# EAGLE design STM32L0 (EAGLE 9.6.2)

## Sheet 1 of 2
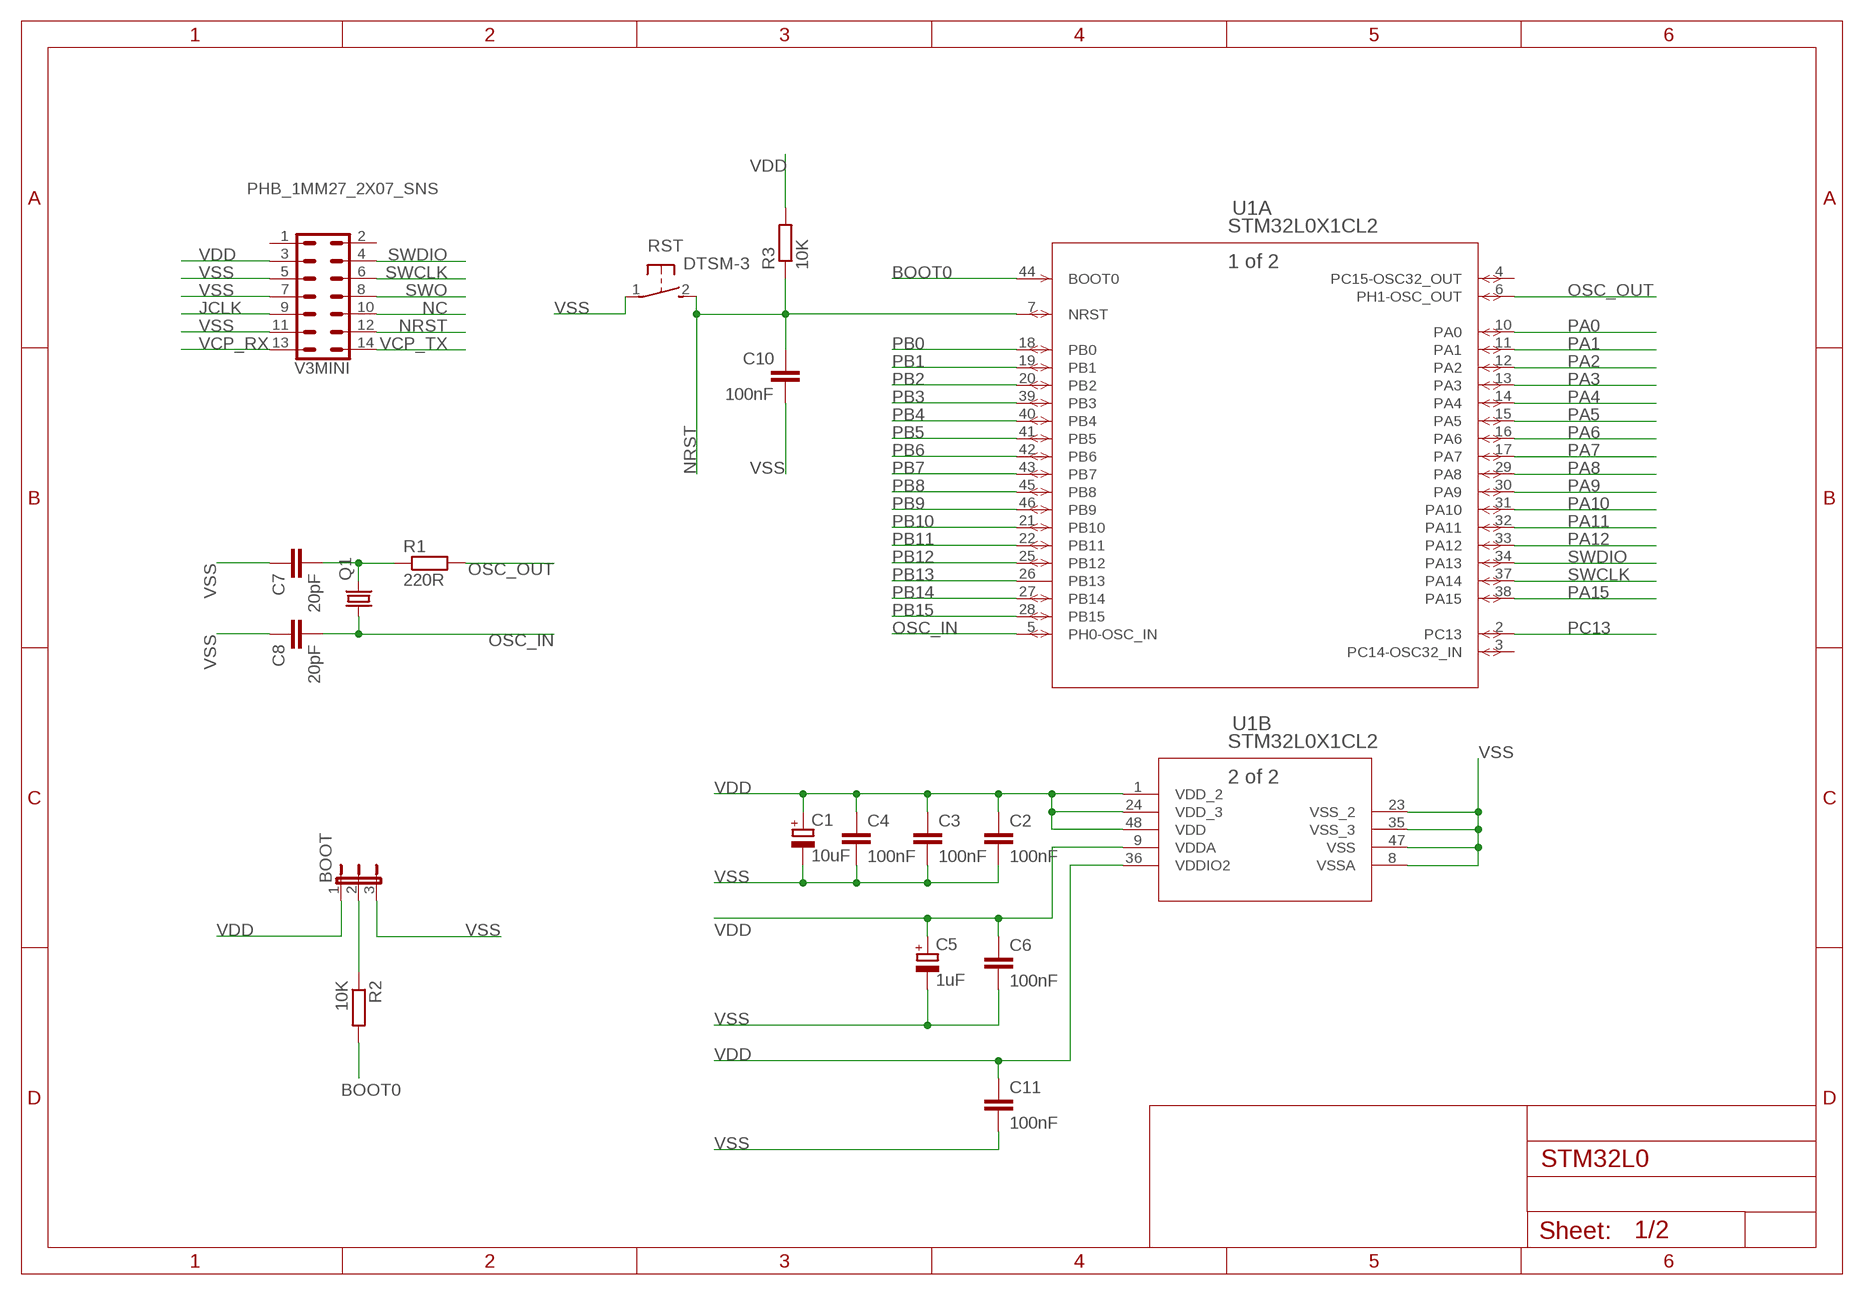
[diagram p0: schematic, sheet 1]

### Parts
BOOT  JP2E  [JP2]
C1  10uF  CPOL-EUSMCA  [SMC_A]
C2  100nF  C-EUC0805  [C0805]
C3  100nF  C-EUC0805  [C0805]
C4  100nF  C-EUC0805  [C0805]
C5  1uF  CPOL-EUSMCA  [SMC_A]
C6  100nF  C-EUC0805  [C0805]
C7  20pF  C-EUC0805  [C0805]
C8  20pF  C-EUC0805  [C0805]
C10  100nF  C-EUC0805  [C0805]
C11  100nF  C-EUC0805  [C0805]
Q1  CRYSTALSM49  [SM49]
R1  220R  R-EU_R0805  [R0805]
R2  10K  R-EU_R0805  [R0805]
R3  10K  R-EU_R0805  [R0805]
RST  DTSM-3  [DTSM-3]
U1  STM32L0X1CL2  [LQFP48-7X7MM]
V3MINI  PHB_1MM27_2X07_SNS  [PHB_1MM27_2X07_SNS]

### Nets
BOOT0: R2.2 U1.44(A:BOOT0)
JCLK: V3MINI.9
N$1: C7.2 Q1.2 R1.1
N$2: BOOT.2 R2.1
NC: V3MINI.10
NRST: C10.1 R3.1 RST.2 U1.7(A:NRST) V3MINI.12
OSC_IN: C8.2 Q1.1 U1.5(A:PH0-OSC_IN)
OSC_OUT: R1.2 U1.6(A:PH1-OSC_OUT)
PA0: U1.10(A:PA0) ; also sheet 2
PA1: U1.11(A:PA1) ; also sheet 2
PA2: U1.12(A:PA2) ; also sheet 2
PA3: U1.13(A:PA3) ; also sheet 2
PA4: U1.14(A:PA4) ; also sheet 2
PA5: U1.15(A:PA5) ; also sheet 2
PA6: U1.16(A:PA6) ; also sheet 2
PA7: U1.17(A:PA7) ; also sheet 2
PA8: U1.29(A:PA8) ; also sheet 2
PA9: U1.30(A:PA9) ; also sheet 2
PA10: U1.31(A:PA10) ; also sheet 2
PA11: U1.32(A:PA11) ; also sheet 2
PA12: U1.33(A:PA12) ; also sheet 2
PA15: U1.38(A:PA15) ; also sheet 2
PB0: U1.18(A:PB0) ; also sheet 2
PB1: U1.19(A:PB1) ; also sheet 2
PB2: U1.20(A:PB2) ; also sheet 2
PB3: U1.39(A:PB3) ; also sheet 2
PB4: U1.40(A:PB4) ; also sheet 2
PB5: U1.41(A:PB5) ; also sheet 2
PB6: U1.42(A:PB6) ; also sheet 2
PB7: U1.43(A:PB7) ; also sheet 2
PB8: U1.45(A:PB8) ; also sheet 2
PB9: U1.46(A:PB9) ; also sheet 2
PB10: U1.21(A:PB10) ; also sheet 2
PB11: U1.22(A:PB11) ; also sheet 2
PB12: U1.25(A:PB12) ; also sheet 2
PB13: U1.26(A:PB13) ; also sheet 2
PB14: U1.27(A:PB14) ; also sheet 2
PB15: U1.28(A:PB15) ; also sheet 2
PC13: U1.2(A:PC13) ; also sheet 2
SWCLK: U1.37(A:PA14) V3MINI.6
SWDIO: U1.34(A:PA13) V3MINI.4
SWO: V3MINI.8
VCP_RX: V3MINI.13
VCP_TX: V3MINI.14
VDD: BOOT.1 C1.+ C2.1 C3.1 C4.1 C5.+ C6.1 C11.1 R3.2 U1.1(B:VDD_2) U1.9(B:VDDA) U1.24(B:VDD_3) U1.36(B:VDDIO2) U1.48(B:VDD) V3MINI.3 ; also sheet 2
VSS: BOOT.3 C1.- C2.2 C3.2 C4.2 C5.- C6.2 C7.1 C8.1 C10.2 C11.2 RST.1 U1.8(B:VSSA) U1.23(B:VSS_2) U1.35(B:VSS_3) U1.47(B:VSS) V3MINI.5 V3MINI.7 V3MINI.11 ; also sheet 2
Unconnected: U1.3(A:PC14-OSC32_IN) U1.4(A:PC15-OSC32_OUT) V3MINI.1 V3MINI.2

## Sheet 2 of 2
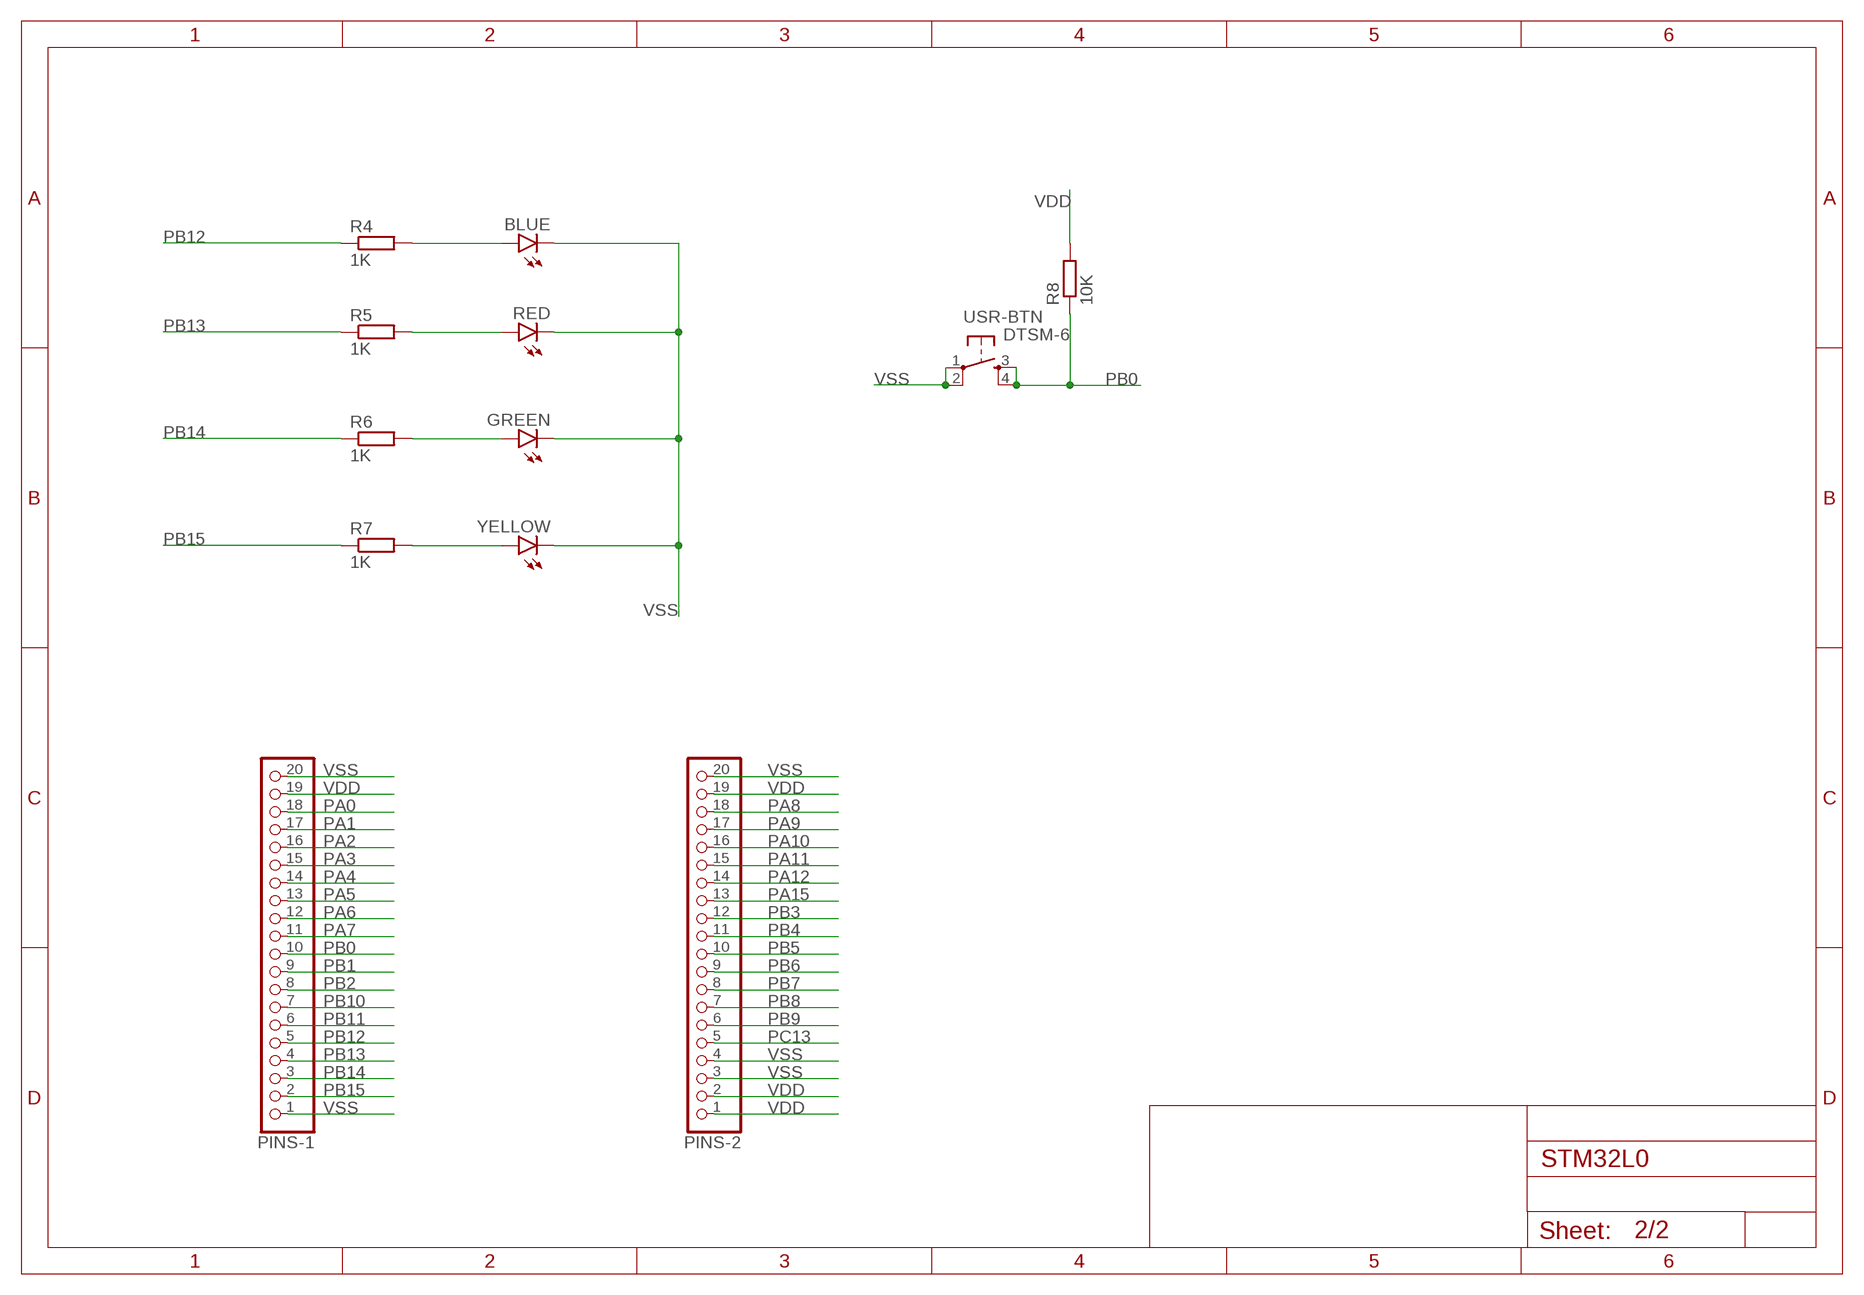
[diagram p1: schematic, sheet 2]

### Parts
BLUE  LEDCHIPLED_0805  [CHIPLED_0805]
GREEN  LEDCHIPLED_0805  [CHIPLED_0805]
PINS-1  PINHD-1X20  [1X20]
PINS-2  PINHD-1X20  [1X20]
R4  1K  R-EU_R0805  [R0805]
R5  1K  R-EU_R0805  [R0805]
R6  1K  R-EU_R0805  [R0805]
R7  1K  R-EU_R0805  [R0805]
R8  10K  R-EU_R0805  [R0805]
RED  LEDCHIPLED_0805  [CHIPLED_0805]
USR-BTN  DTSM-6  [DTSM-6]
YELLOW  LEDCHIPLED_0805  [CHIPLED_0805]

### Nets
N$4: BLUE.A R4.2
N$5: R5.2 RED.A
N$6: GREEN.A R6.2
N$7: R7.2 YELLOW.A
PA0: PINS-1.18 ; also sheet 1
PA1: PINS-1.17 ; also sheet 1
PA2: PINS-1.16 ; also sheet 1
PA3: PINS-1.15 ; also sheet 1
PA4: PINS-1.14 ; also sheet 1
PA5: PINS-1.13 ; also sheet 1
PA6: PINS-1.12 ; also sheet 1
PA7: PINS-1.11 ; also sheet 1
PA8: PINS-2.18 ; also sheet 1
PA9: PINS-2.17 ; also sheet 1
PA10: PINS-2.16 ; also sheet 1
PA11: PINS-2.15 ; also sheet 1
PA12: PINS-2.14 ; also sheet 1
PA15: PINS-2.13 ; also sheet 1
PB0: PINS-1.10 R8.1 USR-BTN.3 USR-BTN.4 ; also sheet 1
PB1: PINS-1.9 ; also sheet 1
PB2: PINS-1.8 ; also sheet 1
PB3: PINS-2.12 ; also sheet 1
PB4: PINS-2.11 ; also sheet 1
PB5: PINS-2.10 ; also sheet 1
PB6: PINS-2.9 ; also sheet 1
PB7: PINS-2.8 ; also sheet 1
PB8: PINS-2.7 ; also sheet 1
PB9: PINS-2.6 ; also sheet 1
PB10: PINS-1.7 ; also sheet 1
PB11: PINS-1.6 ; also sheet 1
PB12: PINS-1.5 R4.1 ; also sheet 1
PB13: PINS-1.4 R5.1 ; also sheet 1
PB14: PINS-1.3 R6.1 ; also sheet 1
PB15: PINS-1.2 R7.1 ; also sheet 1
PC13: PINS-2.5 ; also sheet 1
VDD: PINS-1.19 PINS-2.1 PINS-2.2 PINS-2.19 R8.2 ; also sheet 1
VSS: BLUE.C GREEN.C PINS-1.1 PINS-1.20 PINS-2.3 PINS-2.4 PINS-2.20 RED.C USR-BTN.1 USR-BTN.2 YELLOW.C ; also sheet 1

## Library data of the parts
BLUE GREEN RED YELLOW = led:LED: LED OSRAM: - CHIPLED LG R971, LG N971, LY N971, LG Q971, LY Q971, LO R971, LY R971 LH N974, LH R974 LS Q976, LO Q976, LY Q976 LO Q996 - Hyper CHIPLED LW Q18S LB Q993, LB Q99A, LB R99A - SideLED LS A670, LO A670, LY A670, LG A670, LP A670 LB A673, LV A673, LT A673, LW A673 LH A674 LY A675 LS A676, LA A676, LO A676, LY A676, LW A676 LS A679, LY A679, LG A679 - Hyper Micro SIDELED® LS Y876, LA Y876, LO Y876, LY Y876 LT Y87S - SmartLED LW L88C, LW L88S LB L89C, LB L89S, LG L890 LS L89K, LO L89K, LY L89K LS L896, LA L896, LO L896, LY L896 - TOPLED LS T670, LO T670, LY T670, LG T670, LP T670 LSG T670, LSP T670, LSY T670, LOP T670, LYG T670 LG T671, LOG T671, LSG T671 LB T673, LV T673, LT T673, LW T673 LH T674 LS T676, LA T676, LO T676, LY T676, LB T676, LH T676, LSB T676, LW T676 LB T67C, LV T67C, LT T67C, LS T67K, LO T67K, LY T67K, LW E67C LS E67B, LA E67B, LO E67B, LY E67B, LB E67C, LV E67C, LT E67C LW T67C LS T679, LY T679, LG T679 LS T770, LO T770, LY T770, LG T770, LP T770 LB T773, LV T773, LT T773, LW T773 LH T774 LS E675, LA E675, LY E675, LS T675 LS T776, LA T776, LO T776, LY T776, LB T776 LHGB T686 LT T68C, LB T68C - Hyper Mini TOPLED® LB M676 - Mini TOPLED Santana® LG M470 LS M47K, LO M47K, LY M47K Source: http://www.osram.convergy.de LUXEON: - LUMILED® LXK2-PW12-R00, LXK2-PW12-S00, LXK2-PW14-U00, LXK2-PW14-V00 LXK2-PM12-R00, LXK2-PM12-S00, LXK2-PM14-U00 LXK2-PE12-Q00, LXK2-PE12-R00, LXK2-PE12-S00, LXK2-PE14-T00, LXK2-PE14-U00 LXK2-PB12-K00, LXK2-PB12-L00, LXK2-PB12-M00, LXK2-PB14-N00, LXK2-PB14-P00, LXK2-PB14-Q00 LXK2-PR12-L00, LXK2-PR12-M00, LXK2-PR14-Q00, LXK2-PR14-R00 LXK2-PD12-Q00, LXK2-PD12-R00, LXK2-PD12-S00 LXK2-PH12-R00, LXK2-PH12-S00 LXK2-PL12-P00, LXK2-PL12-Q00, LXK2-PL12-R00 Source: www.luxeon.com KINGBRIGHT: KA-3528ASYC Source: www.kingbright.com
BOOT = jumper:JP2E: JUMPER
C1 C5 = rcl:CPOL-EU: POLARIZED CAPACITOR, European symbol; SPICEPREFIX: C
C2-C4 C6-C8 C10 C11 = rcl:C-EU: CAPACITOR, European symbol; SPICEPREFIX: C
PINS-1 PINS-2 = pinhead:PINHD-1X20: PIN HEADER
Q1 = crystal:CRYSTAL: CRYSTAL; OC_FARNELL: unknown; OC_NEWARK: unknown
R1-R8 = rcl:R-EU_: RESISTOR, European symbol; SPICEPREFIX: R
RST = switch-tact:DTSM-3
U1 = STM32L051C8T6:STM32L0X1CL2; COPYRIGHT: Copyright (C) 2016 Accelerated Designs. All rights reserved; MANUFACTURER_PART_NUMBER: STM32L0X1CL2; VENDOR: STMicroelectronics
USR-BTN = switch-tact:DTSM-6
V3MINI = _hhn_con_pinhead_box_1mm27:PHB_1MM27_2X07_*: Pin Header Box-Type, 1.27mm/0.5"/50mil Pitch, 2x07 Circuits Note: see library description for an important note about THT-version

## Board
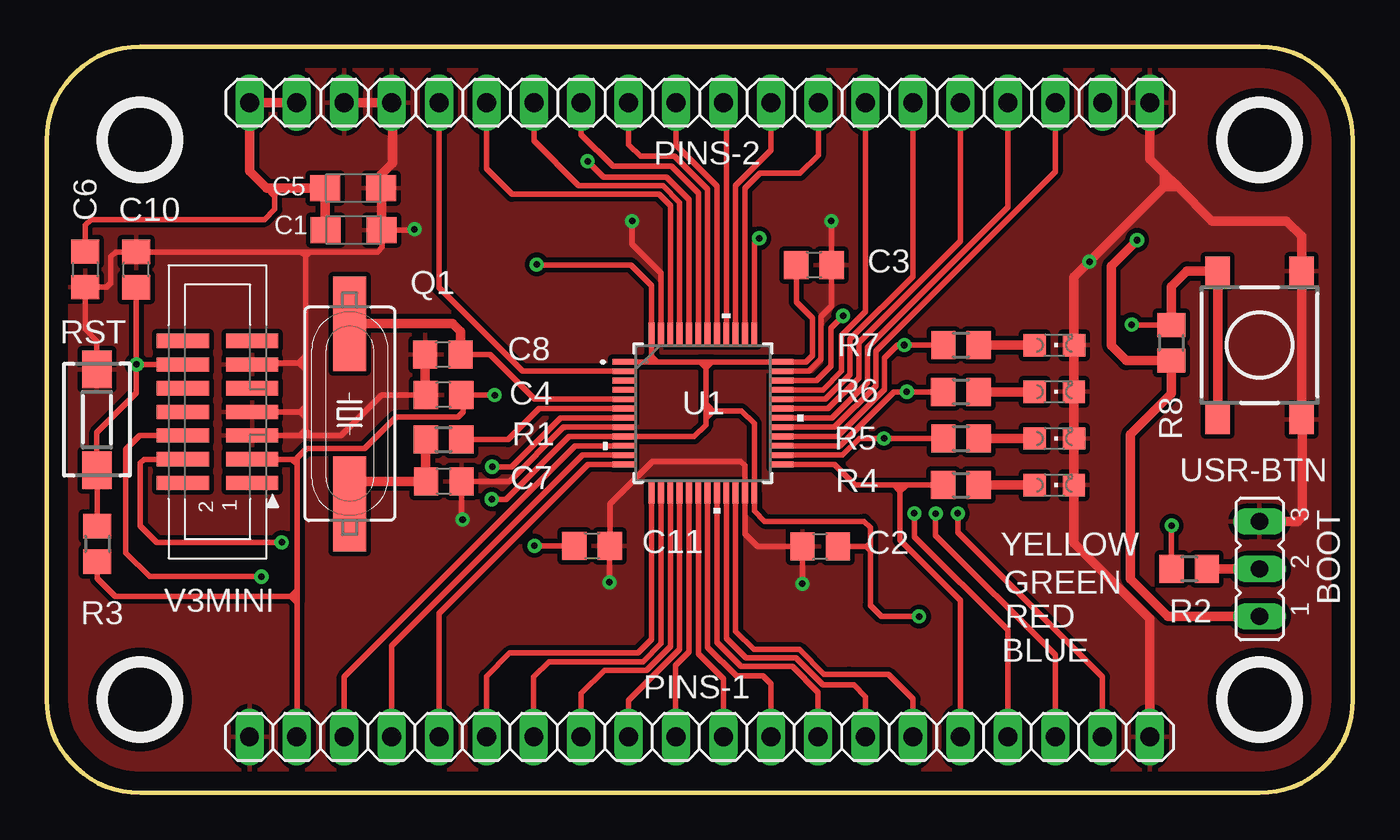
[diagram p2: board, top side]
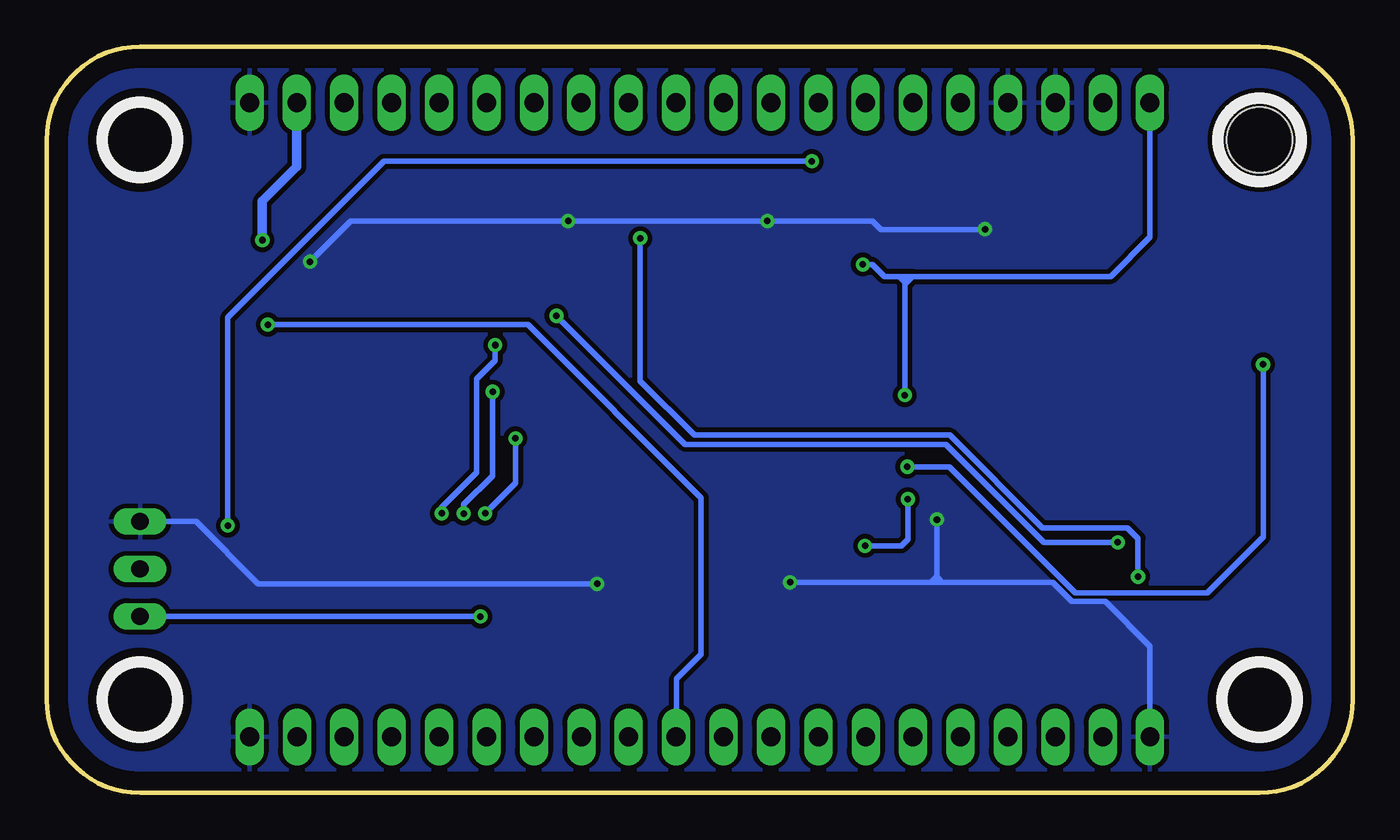
[diagram p3: board, bottom side, seen from below]

Size 70 x 40 mm. Coordinates in mm from the lower left corner, seen from the top.
Outline: 0,5 0,35 arc-90 5,40 65,40 arc-90 70,35 70,5 arc-90 65,0 5,0 arc-90 0,5
Copper layers (1*16): Top 0.035mm / dielectric 1.5mm / Bottom 0.035mm
Design rules "default": minimum track width 6mil, minimum drill 0.35mm, track to track 6mil, track to pad 6mil, pad to pad 6mil, via to via 6mil, smd to smd 6mil, copper to edge 40mil, drill to drill 6mil, minimum pad ring 10mil, minimum via ring 8mil, stop-mask expansion 4mil, vias tented up to drill 0mil, thermal gap 10mil
Holes 3.5 mm at 5,5 65,35 65,5 5,35

### Footprints (pad centres in the part's own frame; a part is rotated, then mirrored left to right if it is on the bottom)
CHIPLED_0805 = smd 1.2 x 1.2: A 0,-1.05; C 0,1.05
JP2 = drill 0.914 long: 1 -2.54,0; 2 0,0; 3 2.54,0
SMC_A = smd 1.6 x 1.4: + -1.5,0; - 1.5,0
C0805 = smd 1.3 x 1.5: 1 -0.95,0; 2 0.95,0
1X20 = drill 1.016 long: 1 -24.13,0; 2 -21.59,0; 3 -19.05,0; 4 -16.51,0; 5 -13.97,0; 6 -11.43,0; 7 -8.89,0; 8 -6.35,0; 9 -3.81,0; 10 -1.27,0; 11 1.27,0; 12 3.81,0; 13 6.35,0; 14 8.89,0; 15 11.43,0; 16 13.97,0; 17 16.51,0; 18 19.05,0; 19 21.59,0; 20 24.13,0
SM49 = smd 5.08 x 1.778: 1 -4.826,0; 2 4.826,0
R0805 = smd 1.3 x 1.5: 1 -0.95,0; 2 0.95,0
DTSM-3 = smd 2 x 1.6: 1 -2.7,0; 2 2.7,0
LQFP48-7X7MM = smd 1.194 x 0.305: 1 -4.25,2.75; 2 -4.25,2.25; 3 -4.25,1.75; 4 -4.25,1.25; 5 -4.25,0.75; 6 -4.25,0.25; 7 -4.25,-0.25; 8 -4.25,-0.75; 9 -4.25,-1.25; 10 -4.25,-1.75; 11 -4.25,-2.25; 12 -4.25,-2.75; 25 4.25,-2.75; 26 4.25,-2.25; 27 4.25,-1.75; 28 4.25,-1.25; 29 4.25,-0.75; 30 4.25,-0.25; 31 4.25,0.25; 32 4.25,0.75; 33 4.25,1.25; 34 4.25,1.75; 35 4.25,2.25; 36 4.25,2.75 | smd 0.305 x 1.194: 13 -2.75,-4.25; 14 -2.25,-4.25; 15 -1.75,-4.25; 16 -1.25,-4.25; 17 -0.75,-4.25; 18 -0.25,-4.25; 19 0.25,-4.25; 20 0.75,-4.25; 21 1.25,-4.25; 22 1.75,-4.25; 23 2.25,-4.25; 24 2.75,-4.25; 37 2.75,4.25; 38 2.25,4.25; 39 1.75,4.25; 40 1.25,4.25; 41 0.75,4.25; 42 0.25,4.25; 43 -0.25,4.25; 44 -0.75,4.25; 45 -1.25,4.25; 46 -1.75,4.25; 47 -2.25,4.25; 48 -2.75,4.25
DTSM-6 = smd 1.55 x 1.3: 1 -3.975,2.25; 2 3.975,2.25; 3 -3.975,-2.25; 4 3.975,-2.25
PHB_1MM27_2X07_SNS = smd 0.76 x 2.8: 1 -3.81,-1.85; 2 -3.81,1.85; 3 -2.54,-1.85; 4 -2.54,1.85; 5 -1.27,-1.85; 6 -1.27,1.85; 7 0,-1.85; 8 0,1.85; 9 1.27,-1.85; 10 1.27,1.85; 11 2.54,-1.85; 12 2.54,1.85; 13 3.81,-1.85; 14 3.81,1.85

### Placement (x,y rotation side)
BLUE  54,16.5 270 top
BOOT  65,12 90 top
C1  16.46,30.17 0 top
C2  41.45,13.2 180 top
C3  41.12,28.3 0 top
C4  21.27,21.33 180 top
C5  16.43,32.41 0 top
C6  2.07,28.06 270 top
C7  21.29,16.69 180 top
C8  21.23,23.5 0 top
C10  4.8,28.05 90 top
C11  29.23,13.25 0 top
GREEN  54,21.5 270 top
PINS-1  35,3 180 top
PINS-2  35,37 0 top
Q1  16.24,20.32 270 top
R1  21.27,18.94 0 top
R2  61.23,12 180 top
R3  2.72,13.34 270 top
R4  49,16.5 0 top
R5  49,19 0 top
R6  49,21.5 0 top
R7  49,24 0 top
R8  60.26,24.12 270 top
RED  54,19 270 top
RST  2.69,20 270 top
U1  35.17,20.35 0 top
USR-BTN  65,24 270 top
V3MINI  9.16,20.42 90 top
YELLOW  54,24 270 top

### Tracks (layer width: path | path; a pad name or v marks a point on that pad's centre or on a via)
BOOT0  (via drill 0.35)
  Top 0.305: U1.44 34.42,31.8 33.22,33 29.85,33 v28.99,33.86 | R2.2 v60.28,14.32 v60.29,14.33
  Bottom 0.305: v60.29,14.33 60.29,25.49 51.92,33.86 v28.99,33.86
N$1
  Top 0.508: R1.1 20.32,16.71 C7.2 16.84,16.69 16.24,16.09 Q1.2
N$2
  Top 0.508: 64.95,12 R2.1
  Top 1.27: BOOT.2 | BOOT.2 64.95,12
N$4
  Top 0.508: R4.2 BLUE.A
N$5
  Top 0.508: R5.2 RED.A
N$6
  Top 0.508: R6.2 GREEN.A
N$7
  Top 0.508: R7.2 YELLOW.A
NRST  (via drill 0.35)
  Top 0.305: U1.7 27.53,20.1 24.91,17.48 v23.88,17.48 | v4.81,22.97 V3MINI.12 | R3.1 2.72,17.28 RST.2 2.69,19.32 4.81,21.43 v4.81,22.97 | C10.1 v4.81,22.97
  Bottom 0.305: v23.88,17.48 21.63,17.48 14.86,10.71 7.81,10.71 4.81,13.71 v4.81,22.97
OSC_IN
  Top 0.305: C8.2 23.76,23.5 26.16,21.1 U1.5
  Top 0.508: C8.2 22.18,24.73 21.75,25.16 16.25,25.16 Q1.1
OSC_OUT
  Top 0.305: U1.6 26.38,20.6 24.72,18.94 R1.2
PA0
  Top 0.305: U1.10 28.33,18.6 15.95,6.22 PINS-1.18
  Top 1.27: PINS-1.18
PA1
  Top 0.305: U1.11 28.71,18.1 18.49,7.88 18.49,3.02
  Top 1.27: PINS-1.17 18.49,3.02
PA2
  Top 0.305: U1.12 29.01,17.6 21.03,9.62 21.03,3.02
  Top 1.27: PINS-1.16 21.03,3.02
PA3
  Top 0.305: U1.13 32.42,8.22 31.69,7.49 24.81,7.49 23.57,6.25 23.57,3.02
  Top 1.27: PINS-1.15 23.57,3.02
PA4
  Top 0.305: U1.14 32.92,8.01 31.95,7.03 26.92,7.03 26.11,6.22 26.11,3.07
  Top 1.27: PINS-1.14 26.11,3.07
PA5
  Top 0.305: U1.15 33.42,7.86 32.14,6.58 29.9,6.58 28.65,5.33 28.65,3.04
  Top 1.27: PINS-1.13 28.65,3.04
PA6
  Top 0.305: U1.16 33.92,7.7 31.19,4.97 31.19,3.06
  Top 1.27: PINS-1.12 31.19,3.06
PA7
  Top 0.305: U1.17 34.42,7.55 33.71,6.84 33.71,3.03
  Top 1.27: PINS-1.11 33.73,3.02 33.71,3.03
PA8
  Top 0.305: U1.29 42.22,19.6 44.43,21.81 44.43,23.68 54.05,33.3 54.05,36.95
  Top 1.27: PINS-2.18 54.05,36.95
PA9
  Top 0.305: U1.30 42.07,20.1 43.98,22 43.98,23.87 51.51,31.41 51.51,36.98
  Top 1.27: PINS-2.17 51.51,36.98
PA10
  Top 0.305: U1.31 41.88,20.6 43.52,22.24 43.52,24.13 48.97,29.58 48.97,36.97
  Top 1.27: PINS-2.16 48.97,36.97
PA11
  Top 0.305: U1.32 41.73,21.1 43.06,22.43 43.06,24.32 46.43,27.69 46.43,36.95
  Top 1.27: PINS-2.15 46.43,36.95
PA12
  Top 0.305: U1.33 41.59,21.6 42.6,22.62 42.6,24.51 43.89,25.79 PINS-2.14
  Top 1.27: PINS-2.14
PA15
  Top 0.305: U1.38 37.42,32.41 38.22,33.21 40.38,33.21 41.35,34.18 41.35,36.93
  Top 1.27: PINS-2.13 41.35,36.93
PB0  (via drill 0.35)
  Top 0.305: U1.18 34.92,7.46 36.27,6.11 36.27,3.03 | R8.1 58.18,25.07 v58.15,25.1
  Top 0.508: USR-BTN.4 USR-BTN.3 61.1,27.97 60.26,27.13 R8.1
  Top 1.27: PINS-1.10 36.27,3.03
  Bottom 0.305: v58.15,25.1 44.21,25.1 34.92,15.81 34.92,7.43 36.24,6.11 36.24,3.02
  Bottom 1.27: PINS-1.10 36.24,3.02
PB1
  Top 0.305: U1.19 35.42,7.81 36.96,6.27 38.38,6.27 38.81,5.84 38.81,3.09
  Top 1.27: PINS-1.9 38.81,3.09
PB2
  Top 0.305: U1.20 35.92,8.07 37.22,6.77 39.96,6.77 41.35,5.38 41.35,3.02
  Top 1.27: PINS-1.8 41.35,3.02
PB3
  Top 0.305: U1.39 36.92,32.56 38.81,34.45 38.81,36.95
  Top 1.27: PINS-2.12 38.81,36.95
PB4
  Top 0.305: U1.40 36.42,36.4 36.27,36.55 36.27,36.95
  Top 1.27: PINS-2.11 36.27,36.95
PB5
  Top 0.305: U1.41 35.92,32.52 33.73,34.71 33.73,36.96
  Top 1.27: PINS-2.10 33.73,36.96
PB6
  Top 0.305: U1.42 35.42,32.36 33.66,34.12 31.82,34.12 31.19,34.75 31.19,36.95
  Top 1.27: PINS-2.9 31.19,36.95
PB7
  Top 0.305: U1.43 34.92,32.15 33.48,33.59 30.34,33.59 28.65,35.28 PINS-2.8
  Top 1.27: PINS-2.8
PB8
  Top 0.305: U1.45 33.92,31.65 33.03,32.54 28.52,32.54 26.11,34.95 PINS-2.7
  Top 1.27: PINS-2.7
PB9
  Top 0.305: U1.46 33.42,31.47 32.8,32.09 24.93,32.09 23.57,33.45 23.57,36.96
  Top 1.27: PINS-2.6 23.57,36.96
PB10
  Top 0.305: U1.21 36.42,8.29 37.48,7.23 40.15,7.23 41.6,5.78 43.25,5.78 43.87,5.16 43.87,3.04
  Top 1.27: PINS-1.7 43.89,3.02 43.87,3.04
PB11
  Top 0.305: U1.22 36.92,8.66 37.9,7.68 40.34,7.68 41.67,6.36 43.01,6.36 43.02,6.35 45.11,6.35 46.43,5.03 46.43,3.05
  Top 1.27: PINS-1.6 46.43,3.05
PB12
  Top 0.305: U1.25 42.22,17.6 43.32,16.5 45.41,16.5 | 45.41,16.5 45.74,16.5 | 45.74,16.5 46.04,16.5 | 46.04,16.5 R4.1 | 45.74,16.5 45.74,16.17 | 45.74,16.15 45.74,13.55 48.97,10.32 48.97,3.02 | 45.74,16.15 46.04,16.45 46.04,16.5 | 45.74,16.15 45.74,16.17 | 45.74,16.17 45.41,16.5
  Top 1.27: PINS-1.5 48.97,3.02
PB13  (via drill 0.35)
  Top 0.305: U1.26 42.66,18.1 43.56,19 v44.88,19 R5.1 | v46.5,14.98 46.51,14.97 46.51,13.73 51.51,8.73 PINS-1.4
  Top 1.27: PINS-1.4
  Bottom 0.305: v44.88,19 44.88,16.6 v46.5,14.98
PB14  (via drill 0.35)
  Top 0.305: U1.27 42.51,18.6 45.41,21.5 v46.1,21.5 R6.1 | v47.65,14.97 v47.64,14.96 47.64,13.81 54.05,7.4 PINS-1.3
  Bottom 0.305: v46.1,21.5 46.1,17 47.65,15.45 v47.65,14.97
PB15  (via drill 0.35)
  Top 0.305: U1.28 42.37,19.1 44.89,21.62 44.89,23.31 45.59,24 v45.96,24 R7.1 | v48.83,14.98 48.83,13.97 56.59,6.21 56.59,3.04
  Top 1.27: PINS-1.2 56.59,3.04
  Bottom 0.305: v45.96,24 45.96,23.18 46.95,22.19 46.95,17.18 48.83,15.3 v48.83,14.98
PC13
  Top 0.305: U1.2 25.51,22.6 21.03,27.08 21.03,36.98
  Top 1.27: PINS-2.5 21.03,36.98
SWCLK  (via drill 0.35)
  Top 0.305: U1.37 37.92,29.46 v38.19,29.73 | V3MINI.6 4.98,19.15 4.24,18.41 4.24,12.87 5.52,11.59 v11.51,11.59
  Bottom 0.305: v38.19,29.73 38.19,22.08 35.29,19.18 21.6,19.18 16.63,14.21 12.08,14.21 11.51,13.64 v11.51,11.59
SWDIO  (via drill 0.35)
  Top 0.305: U1.34 41.25,22.1 42.04,22.89 42.04,24.92 v42.68,25.56 v42.68,25.57 | V3MINI.4 5.22,17.88 5.01,17.67 5.01,14.31 5.89,13.43 v12.6,13.43
  Bottom 0.305: v42.68,25.57 35.79,18.68 21.81,18.68 16.56,13.43 v12.6,13.43
VDD  (via drill 0.35)
  Top 0.305: 43.93,13.2 C2.1 | 44.14,13.41 44.14,14.22 43.8,14.56 38.47,14.56 37.92,15.11 U1.24 37.92,19.79 37.23,20.48 35.71,20.48 | 44.14,13.41 43.93,13.2 | C3.1 40.17,26.31 41.04,25.44 41.04,23.44 40.7,23.1 U1.36 35.63,23.1 | U1.1 32.14,23.1 | 32.14,23.1 32.41,23.1 | 32.41,23.1 32.72,23.1 | 32.72,23.1 35.03,23.1 | 35.03,23.1 35.33,23.1 | 35.33,23.1 35.63,23.1 | 32.42,23.4 U1.48 32.42,27.19 31.31,28.3 26.28,28.3 v26.26,28.32 | 32.42,23.4 32.42,23.11 32.41,23.1 | 32.42,23.4 32.72,23.1 | 32.42,23.4 32.14,23.12 32.14,23.1 | 35.33,20.1 35.33,19.73 34.7,19.1 U1.9 27.99,19.1 24.63,15.74 v23.85,15.74 | 35.33,20.1 35.33,20.48 | 35.33,20.48 35.33,20.76 | 35.33,20.76 35.33,22.8 | 35.33,22.8 35.33,23.1 | 35.33,22.8 35.03,23.1 | 35.33,22.8 35.63,23.1 | 35.71,20.48 35.33,20.48 | 35.71,20.48 35.43,20.76 35.33,20.76 | 35.71,20.48 35.33,20.1 | v26.14,13.24 v26.15,13.25 C11.1 | C4.1 22.33,21.33 | 22.33,21.33 v24,21.33 v24.01,21.32 | 44.14,13.41 44.14,12.99 | 44.14,12.99 44.14,10.06 44.74,9.46 v46.74,9.46 v46.75,9.45 | 43.93,13.2 44.14,12.99 | V3MINI.3 13.14,17.88 | 13.14,17.88 13.33,17.88 13.42,17.79 | 13.42,17.79 13.42,17.6 | 13.42,17.6 13.42,10.85 | 13.42,10.85 13.42,10.53 | 13.42,10.53 13.42,10.21 | 13.42,3.13 13.42,10.21 | C6.1 2.07,30.42 2.39,30.74 11.68,30.74 12.23,31.29 12.23,31.97 | 12.23,32.09 12.23,32.41 | 12.23,31.97 11.79,32.41 | 12.23,31.97 12.23,32.09 | 12.23,32.09 12.55,32.41 | 13.42,17.79 13.42,17.95 13.93,18.46 17.04,18.46 18.72,20.14 22.06,20.14 22.33,20.41 22.33,21.33 | 13.14,17.88 13.42,17.6 | 13.1,10.53 3.68,10.53 2.72,11.49 R3.2 | 13.1,10.53 13.42,10.53 | 13.1,10.53 13.42,10.85 | 13.1,10.53 13.42,10.21
  Top 0.508: C1.+ 14.93,30.2 C5.+ 12.55,32.41 12.23,32.41 11.79,32.41 10.87,33.33 PINS-2.1 13.39,37 | 64.94,9.46 60.09,9.46 58.08,11.47 58.08,19.22 60.26,21.4 R8.2 57.86,23.17 57.06,23.97 57.06,28.25 v58.44,29.63
  Top 1.27: PINS-2.2 13.39,37 | BOOT.1 64.94,9.46 | PINS-1.19 13.41,3.12 13.42,3.13
  Bottom 0.305: v23.85,15.74 23.85,13.58 24.18,13.25 v26.13,13.25 v26.14,13.24 | v24.01,21.32 24.01,27.27 | 10.88,36.92 10.88,29.78 12.98,27.68 23.6,27.68 | 24.01,27.27 23.6,27.68 | 23.6,27.68 24.31,27.68 | 24.31,27.68 25.11,27.68 25.75,28.32 v26.26,28.32 | 24.01,27.27 24.01,27.38 24.31,27.68 | 64.9,9.45 v46.75,9.45
  Bottom 0.508: v58.44,29.63 58.44,31.71 56.59,33.56 56.59,36.94
  Bottom 1.27: PINS-2.1 10.88,36.99 10.88,36.92 | PINS-2.19 56.59,36.94 | BOOT.1 64.9,9.45
VSS  (via drill 0.35)
  Top 0.305: U1.8 27.71,19.6 24.8,16.69 C7.1 22.24,14.7 v22.29,14.65 | U1.47 32.92,27.87 31.38,29.41 v31.38,30.65 | U1.35 40.85,22.6 41.5,23.25 41.5,25.53 42.07,26.1 C3.2 42.07,30.63 v42.05,30.65 | v40.5,11.21 C2.2 38.09,13.2 37.42,13.87 U1.23 37.42,17.54 37.19,17.77 32.47,17.77 30.18,15.48 C11.2 30.16,13.23 v30.16,11.29 | v19.71,30.21 19.67,30.17 C1.- 17.99,30.14 17.99,29.25 17.74,29 14.1,29 | C4.2 17.95,21.33 15.77,19.15 14.16,19.15 | 14.16,19.15 13.87,19.15 | 13.87,19.15 13.58,19.15 | 13.58,19.15 V3MINI.5 | 13.87,19.15 13.87,19.44 | 13.87,19.44 13.87,20.15 | 13.87,20.15 13.87,20.41 | 13.87,20.41 13.87,20.71 | 13.87,20.71 13.87,22.68 | 13.87,22.68 13.87,22.85 | 13.51,23.04 13.68,23.04 13.87,22.85 | 13.51,23.04 11.09,23.04 | V3MINI.7 13.58,20.42 | 13.6,20.42 13.86,20.42 13.87,20.41 | 13.58,20.42 13.87,20.71 | 13.58,20.42 13.6,20.42 | 13.6,20.42 13.87,20.15 | 13.87,19.44 13.58,19.15 | 13.87,19.44 14.16,19.15 | 13.64,29 C10.2 3.69,29 3.43,28.74 3.43,27.33 3.21,27.11 C6.2 2.07,24.85 2.69,24.23 RST.1 | 13.64,29 13.84,29 | 13.84,29 14.1,29 | 13.87,22.85 13.87,23.35 | 13.87,23.35 13.87,28.77 | 13.87,28.77 13.87,28.97 13.84,29 | 13.87,28.77 13.64,29 | 13.87,28.77 14.1,29 | 13.51,23.04 13.82,23.35 13.87,23.35 | 13.51,23.04 13.87,22.68
  Top 0.508: C8.1 20.28,21.37 C4.2 | C1.- 17.96,32.38 C5.- 17.93,33.15 18.54,33.76 18.54,36.95 PINS-2.4 | 18.44,37 15.97,37 | 59.13,36.96 59.13,33.97 59.9,33.2 | 60.61,32.49 62.44,30.66 66.44,30.66 67.25,29.85 USR-BTN.1 USR-BTN.2 67.3,19.98 67.3,14.78 67.06,14.54 65.06,14.54 | 60.61,32.49 60.26,32.84 | 60.26,32.84 59.9,33.2 | PINS-1.1 59.13,9.31 55.05,13.39 BLUE.C 55.05,18.99 RED.C GREEN.C YELLOW.C 55.05,27.64 v55.88,28.48 59.9,32.49 | 59.9,32.49 60.26,32.84 | 59.9,32.49 59.9,33.2 | 59.9,32.49 60.61,32.49 | 11.09,23.04 V3MINI.11
  Top 1.27: PINS-1.1 | PINS-2.3 15.97,37 | PINS-2.4 18.44,37 | PINS-2.20 59.13,36.96 | BOOT.3 65.06,14.54
  Bottom 0.305: v55.88,28.48 53.71,30.65 v42.05,30.65 v31.38,30.65 25.75,30.65 25.29,30.19 19.73,30.19 v19.71,30.21 | v40.5,11.21 58.66,11.21 61.99,14.54 64.97,14.54 | v22.29,14.65 22.29,11.6 | 22.6,11.29 v30.16,11.29 | 22.29,11.6 22.6,11.29 | 10.87,3.03 10.87,7.85 13.27,10.25 15.05,10.25 16.09,11.29 22.01,11.29 | 22.01,11.29 22.6,11.29 | 22.29,11.6 22.01,11.32 22.01,11.29
  Bottom 1.27: BOOT.3 64.97,14.54 | PINS-1.20 10.87,3.03
  pour Top (isolate 0.254): -3,43 75,43 75,34 75,-3 63,-3 -3,-3
  pour Bottom (isolate 0.254): -7,46 79,46 79,43 79,-6 69,-6 -7,-6